# EAGLE design MRCS-Candlestick-Base (EAGLE 7.7.0)
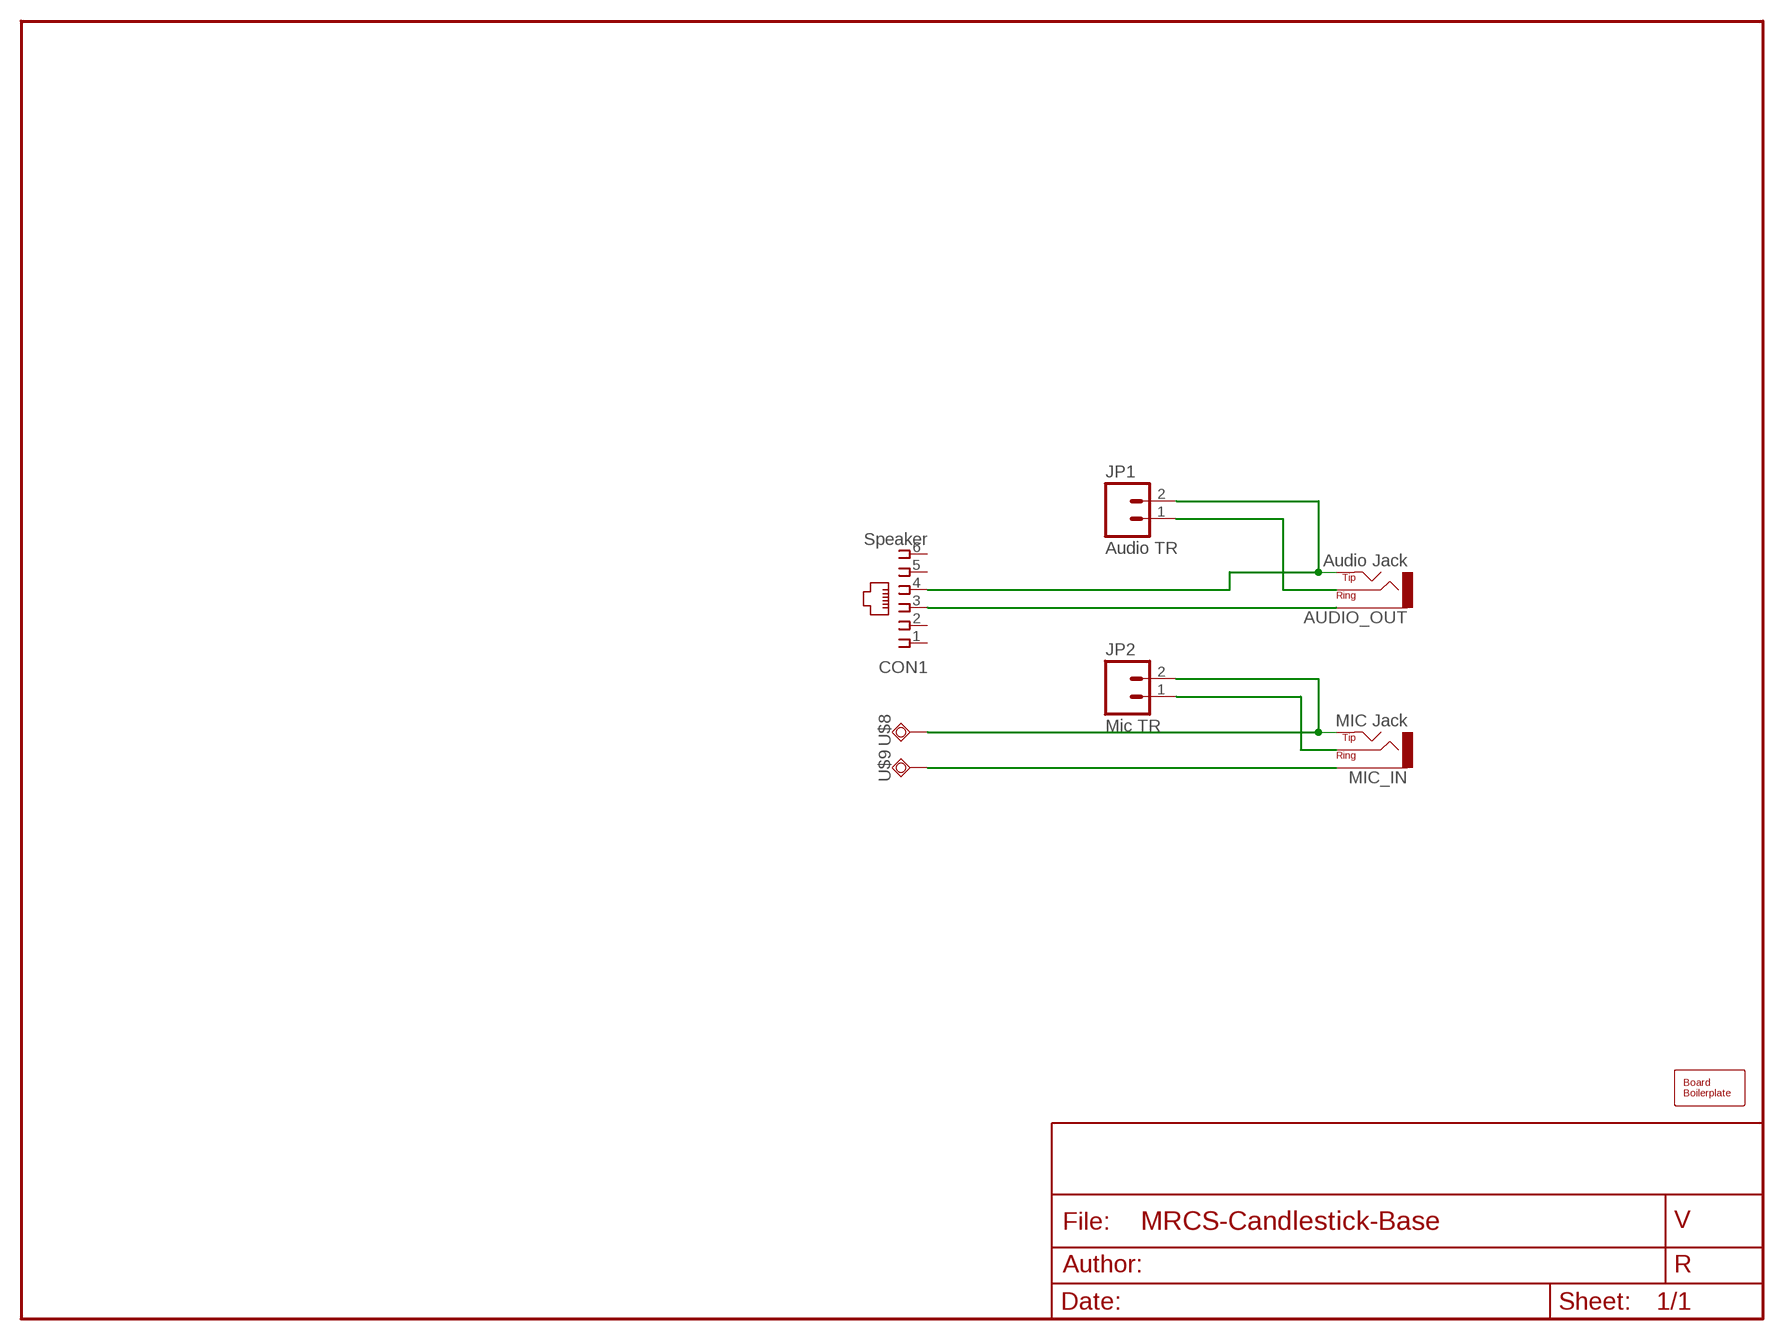
[diagram p0: schematic, sheet 1]

## Parts
AUDIO_OUT  Audio Jack  CONNECTOR-AUDIO3.5MM-ADAMTECH  [AUDIO-JACK-3.5MM_STEREO]
BOARD1  BOARD69X50  [BOARD-DINRAIL-2.7IN-5CM]
CON1  Speaker  CONNECTOR-RJ25-43860-2-MOLEX  [RJ25-INVERTED]
JP1  Audio TR  CONNECTOR-M02MOLEX-1X02-LOCK  [MOLEX-1X2_LOCK]
JP2  Mic TR  CONNECTOR-M02MOLEX-1X02-LOCK  [MOLEX-1X2_LOCK]
MIC_IN  MIC Jack  CONNECTOR-AUDIO3.5MM-ADAMTECH  [AUDIO-JACK-3.5MM_STEREO]
U$8  SPADELUG.4  [SPADELUGPAD]
U$9  SPADELUG.4  [SPADELUGPAD]

## Nets
N$1: AUDIO_OUT.TIP CON1.4 JP1.2(B)
N$2: AUDIO_OUT.GND(SLEEVE) CON1.3
N$3: AUDIO_OUT.RING JP1.1(A)
N$4: MIC_IN.GND(SLEEVE) U$9.P1(TP)
N$5: JP2.2(B) MIC_IN.TIP U$8.P1(TP)
N$6: JP2.1(A) MIC_IN.RING
Unconnected: CON1.1 CON1.2 CON1.5 CON1.6

## Library data of the parts
AUDIO_OUT MIC_IN = SPCoast:CONNECTOR-AUDIO: 3.5mm Audio Jack PCB mount SKU: PRT-08032
BOARD1 = SPCoast:BOARD
CON1 = SPCoast:CONNECTOR-RJ25: AMP connector
JP1 JP2 = SPCoast:CONNECTOR-M02: PHOENIX CONNECTOR
U$8 U$9 = SPCoast:SPADELUG

## Net classes
0 default: width 0.305 mm, drill 0.127 mm, clearance 0.254 mm
1 Power: width 0.61 mm, drill 0.127 mm, clearance 0.254 mm
2 Phone: width 0.305 mm, drill 0.127 mm, clearance 0.381 mm
3 Nasty Loads: width 0.61 mm, clearance 0.61 mm

## Board
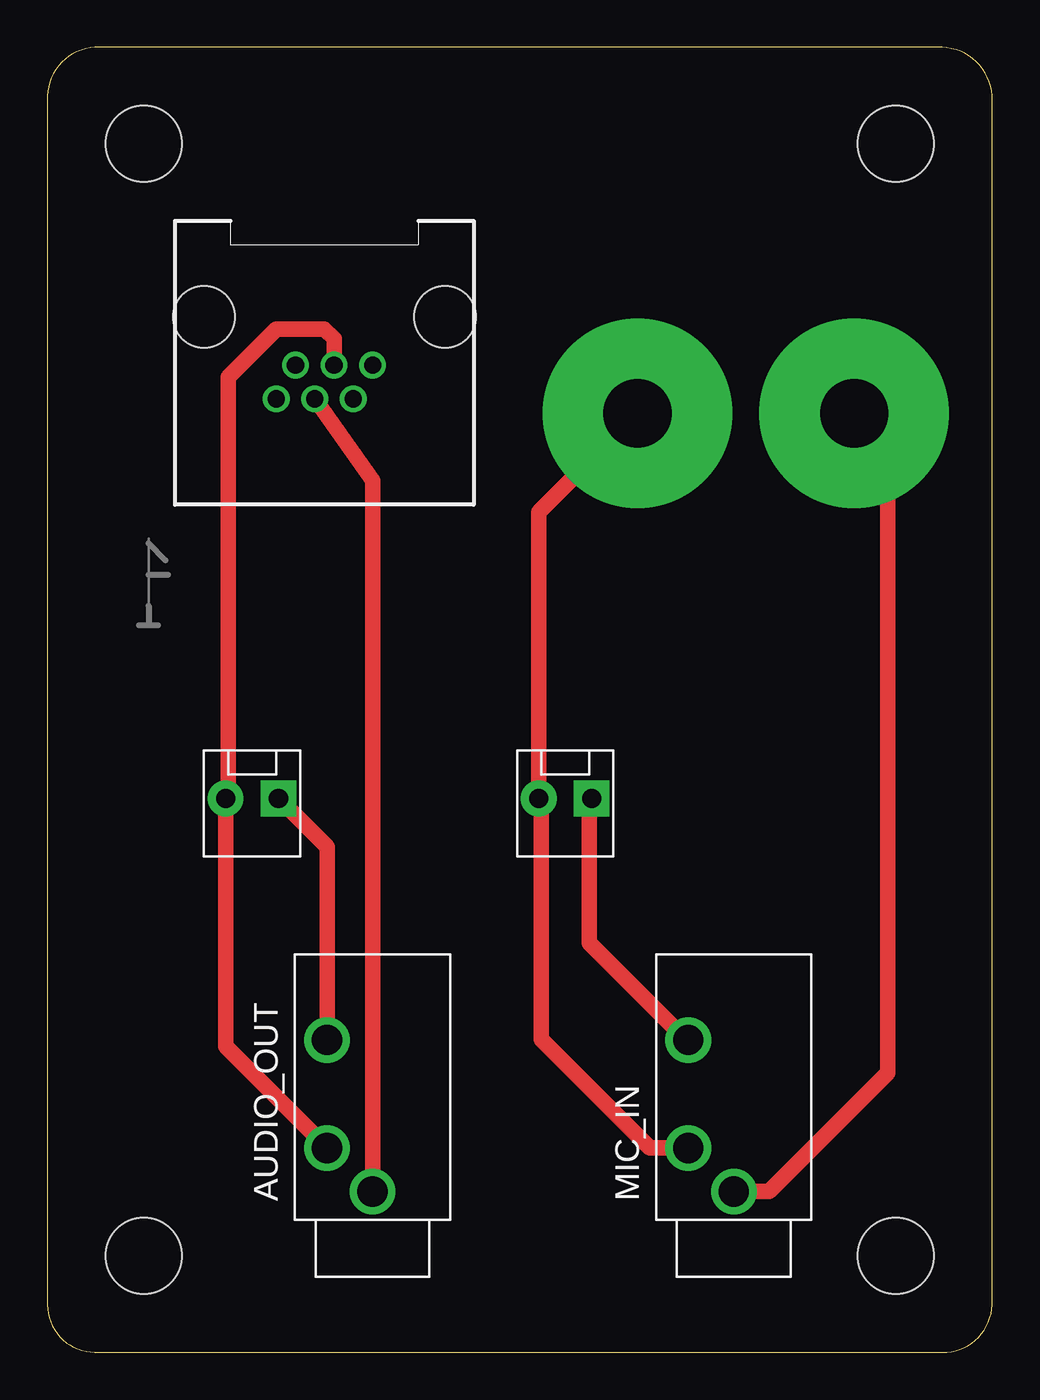
[diagram p1: board, top side]

Size 49.82 x 68.83 mm. Coordinates in mm from the lower left corner, seen from the top.
Copper layers (1*16): Top 0.035mm / dielectric 1.5mm / Bottom 0.035mm
Design rules "default": minimum track width 10mil, minimum drill 0.6mm, track to track 8mil, track to pad 8mil, pad to pad 8mil, via to via 8mil, smd to smd 8mil, copper to edge 40mil, drill to drill 8mil, minimum pad ring 10mil, minimum via ring 8mil, stop-mask expansion 4mil, vias tented up to drill 0mil, thermal gap 10mil

### Footprints (pad centres in the part's own frame; a part is rotated, then mirrored left to right if it is on the bottom)
AUDIO-JACK-3.5MM_STEREO = drill 1.6: GND -5.5,0; RING 2.5,2.4; TIP -3.2,2.4
BOARD-DINRAIL-2.7IN-5CM = hole 4: 44.742,5.08; 5.08,63.754; 44.742,63.754; 5.08,5.08
RJ25-INVERTED = drill 0.9 pad 1.4: 1 2.54,4.318; 2 1.524,2.54; 3 0.508,4.318; 4 -0.508,2.54; 5 -1.524,4.318; 6 -2.54,2.54 | hole 3.251: -6.35,0; 6.35,0
MOLEX-1X2_LOCK = drill 1.016 pad 1.88 square: 1 -0.127,0 | drill 1.016 pad 1.88: 2 2.667,0
SPADELUGPAD = drill 3.6 pad 10: P1 0,0

### Placement (x,y rotation side)
AUDIO_OUT  17.15,13.97 90 top
BOARD1  0,0 0 top
CON1  14.61,54.61 180 top
JP1  12.07,29.21 180 top
JP2  28.58,29.21 180 top
MIC_IN  36.2,13.97 90 top
U$5  [MRCSLOGOTOP]  4.07,37.85 0 top
U$6  [MRCSLOGOBTM]  4.07,37.85 0 top
U$7  [CA-PROP65-BACK]  48.64,33.27 0 top
U$8  31.12,49.53 0 top
U$9  42.55,49.53 0 top

### Tracks (layer width: path | path; a pad name or v marks a point on that pad's centre or on a via)
N$1
  Top 0.813: CON1.4 15.12,53.47 14.61,53.98 12.07,53.98 9.53,51.44 9.53,29.34 JP1.2 9.4,16.12 AUDIO_OUT.TIP
N$2
  Top 0.813: AUDIO_OUT.GND 17.15,45.97 CON1.3
N$3
  Top 0.813: AUDIO_OUT.RING 14.75,26.66 JP1.1
N$4
  Top 0.406: 44.33,47.5 44.33,47.75
  Top 0.813: MIC_IN.GND 38.06,8.47 44.33,14.73 44.33,47.5 | 44.33,47.75 U$9.P1
N$5
  Top 0.305: 26.04,29.08 JP2.2
  Top 0.406: 25.91,44.25 25.91,44.32
  Top 0.813: JP2.2 25.91,44.25 | MIC_IN.TIP 31.78,10.77 26.04,16.51 26.04,29.08 | 25.91,44.32 U$8.P1
N$6
  Top 0.305: MIC_IN.RING 33.7,16.47 | 28.58,29.08 JP2.1
  Top 0.813: 33.7,16.47 28.58,21.59 28.58,29.08

### Text on the board
tDocu: Candlestick phone adapter | Mic + Mic -
_tNames: AUDIO_OUT | MIC_IN